# Altium schematic sheet battery.SchDoc
size 297 x 209 mm; Address1: Address1; Address2: Address2; Address3: Address3; Address4: Address4; SheetNumber: 1; Scale: 1:1; Обозначение документа: АБВГ.123456.001Э3
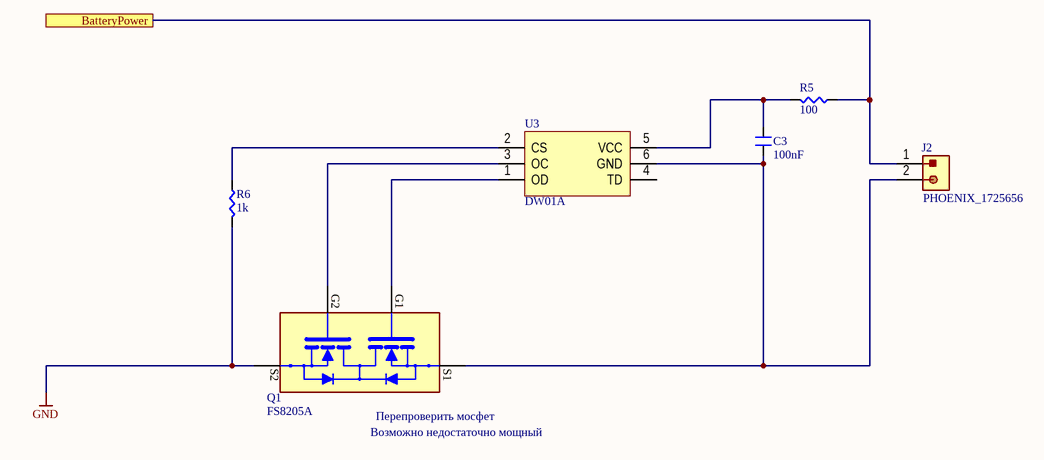
[diagram p0: battery.SchDoc]

## Parts
C3  100nF  [CAP0603]
J2  PHOENIX_1725656  [PHOENIX_1725656]
Q1  FS8205A  [TSSOP-8_MOSFET]
R5  100  [RES0603]
R6  1k  [RES0603]
U3  DW01A  [SOT-23-6]

## Ports
BatteryPower

## Nets
GND: Q1.S2 R6.1
BatteryPower: J2.1 R5.2 ; port BatteryPower
NetC3_1: C3.1 J2.2 Q1.S1 U3.6(GND)
NetC3_2: C3.2 R5.1 U3.5(VCC)
NetQ1_G1: Q1.G1 U3.1(OD)
NetQ1_G2: Q1.G2 U3.3(OC)
NetR6_2: R6.2 U3.2(CS)

Not connected (* = marked no-connect by the designer): U3 4(TD)

## Notes on the sheet
- (near Q1) Перепроверить мосфет
- Возможно недостаточно мощный
- Подп. и дата
- Инв. № дубл.
- Взам. инв. №
- Инв. № подл.
- Изм.
- Лист
- № докум.
- Подп.
- Дата
- Копировал
- Формат А4

## Library data of the parts
C3 = GCM188R71H104KA57J: Tolerance ±10% / Rated Voltage 50Vdc / Temperature 0±30ppm/℃; Manufacturer: Arrow Electronics; Item: 100nF 50V  ±10%; Vdc: 50V; Part Number: GCM188R71H104KA57J; Supplier 1: Mouser; Supplier Part Number 1: 81-GCM188R71H104KA7J; Case: 0603; Tolerance: 10%; Value: 100nF; HelpURL: http://www.farnell.com/datasheets/4360.pdf?src-supplier=Element14; Category: Multilayer Ceramic Capacitors - SMD/SMT
J2 = 1725656: Fixed Terminal Blocks 2P 2.54mm 90DEG; Manufacturer: Phoenix Contact; Part Number: 1725656; Item: PHOENIX_1725656; Supplier 1: Mouser; Case: Female; HelpURL: https://eu.mouser.com/datasheet/2/324/4/1725656-1437410.pdf
Q1 = FS8205A: Dual N-Channel Enhancement Mode Power MOSFET; Manufacturer: Fortune Semiconductor; FET Type: 2 N-Channel (Dual) Common Drain; Vds: 20V; Id: 6A; Case: TSSOP-8; Supplier 1: Chip-Dip; Supplier Part Number 1: FS8205A; ComponentLink1Description: HelpURL; ComponentLink1URL: https://www.vishay.com/docs/76933/sisf02dn.pdf; Item: FS8205A; Part Number: FS8205A; Channel: N-Channel; HelpURL: https://www.ic-fortune.com/upload/Download/FS8205A-DS-12_EN.pdf; Category: MOSFET
R5 = 652-CR0603AFX1000ELF: Tolerance ±1% / Power (Watts) 0.1W, 1/10W / Temperature Coefficient ±100ppm/°C; Manufacturer: Bourns; Item: 100  ±1% 0.1W; Tolerance: 0.01; Part Number: 652-CR0603AFX1000ELF; Supplier 1: Mouser; Case: 0603; Value: 100; HelpURL: https://eu.mouser.com/datasheet/2/427/VISH_S_A0003599164_1-2569050.pdf; Category: Thin Film Resistors - SMD
R6 = CRT0603-FY-1001ELF: Tolerance ±1% / Power (Watts) 0.1W, 1/10W / Temperature Coefficient ±25ppm/°C; Manufacturer: Bourns; Item: 1k ±1% 0.1W; Tolerance: 0.01; Part Number: CRT0603-FY-1001ELF; Supplier 1: Mouser; Supplier Part Number 1: 652-CRT0603FY1001ELF; Case: 0603; Value: 1k; HelpURL: https://eu.mouser.com/datasheet/2/54/CRT-1649066.pdf; Category: Thin Film Resistors - SMD
U3 = DW01A: Battery Management Battery Protection IC; Manufacturer: H&M Semiconductor; Part Number: DW01A; Item: DW01A; Supplier 1: Chip-Dip; Supplier Part Number 1: DW01A; Case: SOT-23-6; HelpURL: https://hmsemi.com/downfile/DW01A.PDF; Category: Battery Management